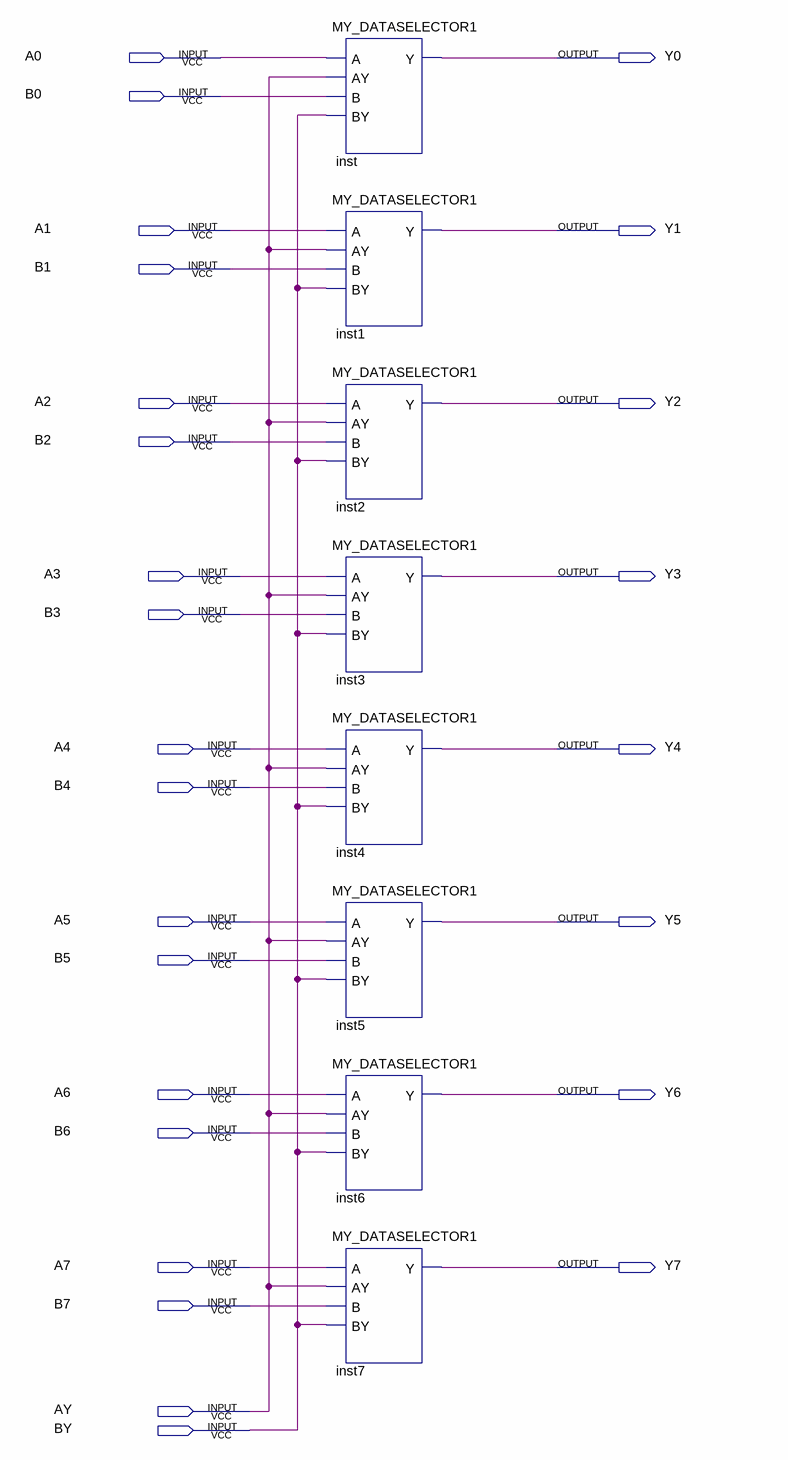
[diagram p0: schematic sheet]
// Quartus schematic MY_DATASELECTOR8.bdf as structural Verilog: 8 symbols, 26 pins
module MY_DATASELECTOR8 (
  input  A0,
  input  B0,
  input  A1,
  input  B1,
  input  A2,
  input  B2,
  input  A3,
  input  B3,
  input  A4,
  input  B4,
  input  A5,
  input  B5,
  input  A6,
  input  B6,
  input  A7,
  input  B7,
  input  AY,
  input  BY,
  output Y0,
  output Y1,
  output Y2,
  output Y3,
  output Y4,
  output Y5,
  output Y6,
  output Y7
);

  MY_DATASELECTOR1 inst (.A(A0), .AY(AY), .B(B0), .BY(BY), .Y(Y0));
  MY_DATASELECTOR1 inst1 (.A(A1), .AY(AY), .B(B1), .BY(BY), .Y(Y1));
  MY_DATASELECTOR1 inst2 (.A(A2), .AY(AY), .B(B2), .BY(BY), .Y(Y2));
  MY_DATASELECTOR1 inst3 (.A(A3), .AY(AY), .B(B3), .BY(BY), .Y(Y3));
  MY_DATASELECTOR1 inst4 (.A(A4), .AY(AY), .B(B4), .BY(BY), .Y(Y4));
  MY_DATASELECTOR1 inst5 (.A(A5), .AY(AY), .B(B5), .BY(BY), .Y(Y5));
  MY_DATASELECTOR1 inst6 (.A(A6), .AY(AY), .B(B6), .BY(BY), .Y(Y6));
  MY_DATASELECTOR1 inst7 (.A(A7), .AY(AY), .B(B7), .BY(BY), .Y(Y7));
endmodule
